# Altium project MainBoard.PrjPcb
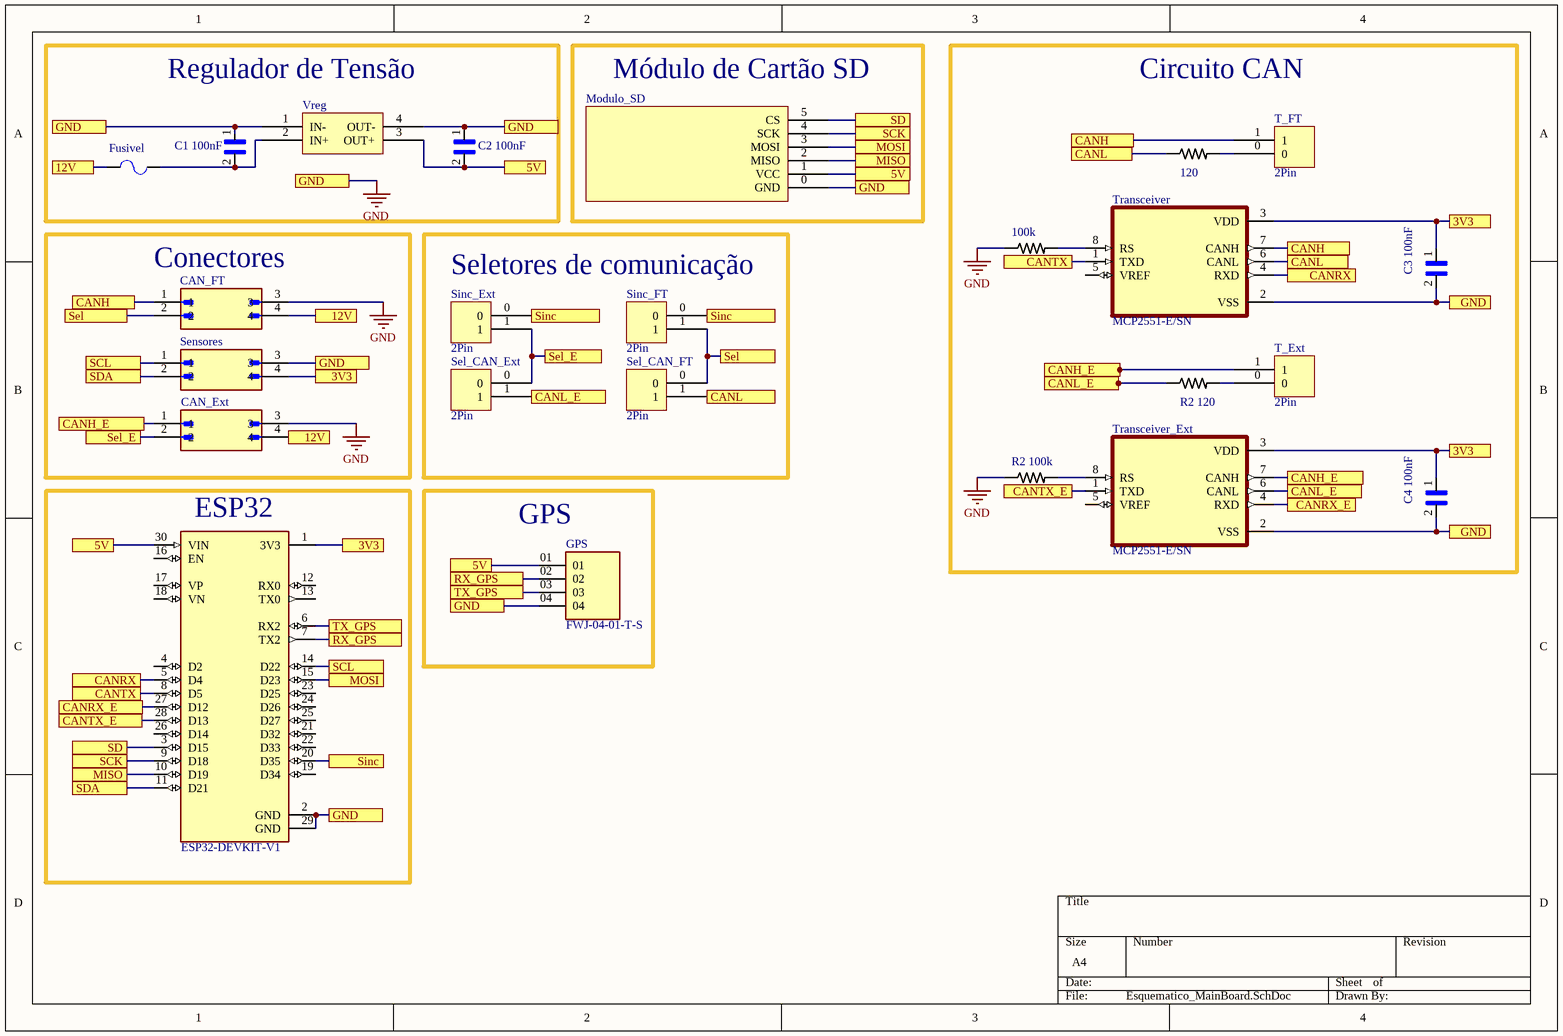
[diagram p0: Esquematico_MainBoard.SchDoc]
1 sheet, 24 parts. Net scope: flat (ports and power ports of the same name join across sheets).
Board file: PCB_MainBoard_Final.PcbDoc

## Sheet Esquematico_MainBoard.SchDoc
size A4; SheetNumber: 1; SheetTotal: 1

### Parts
100k  CRG1206F620K  [RESC3115X65N]  (value not drawn)
120  CRG1206F620K  [RESC3115X65N]  (value not drawn)
C1_100nF  C2012X5R1E225M085AC  [*CAPC2012X100N]  (value not drawn)
C2_100nF  C2012X5R1E225M085AC  [*CAPC2012X100N]  (value not drawn)
C3_100nF  C2012X5R1E225M085AC  [*CAPC2012X100N]  (value not drawn)
C4_100nF  C2012X5R1E225M085AC  [*CAPC2012X100N]  (value not drawn)
CAN_Ext  874270402  [MOLEX_874270402]  (value not drawn)
CAN_FT  874270402  [MOLEX_874270402]  (value not drawn)
Fusivel  F1206B3R00FWTR  [*FUSM3216X140N]  (value not drawn)
GPS  FWJ-04-01-T-S  [SAMTEC_FWJ-04-01-T-S]
Modulo_SD  Component_1  [MICROSD_MODULE]  (value not drawn)
R2_100k  CRG1206F620K  [RESC3115X65N]  (value not drawn)
R2_120  CRG1206F620K  [RESC3115X65N]  (value not drawn)
Sel_CAN_Ext  2Pin  [2Pin]
Sel_CAN_FT  2Pin  [2Pin]
Sensores  874270402  [MOLEX_874270402]  (value not drawn)
Sinc_Ext  2Pin  [2Pin]
Sinc_FT  2Pin  [2Pin]
T_Ext  2Pin  [2Pin]
T_FT  2Pin  [2Pin]
Transceiver  MCP2551-E/SN  [SOIC127P600X175-8N]
Transceiver_Ext  MCP2551-E/SN  [SOIC127P600X175-8N]
Vreg  Component_1  [PCBComponent_1]  (value not drawn)
  ESP32-DEVKIT-V1  [MODULE_ESP32_DEVKIT_V1]

### Blocks framed on the sheet
Regulador de Tensão: C1_100nF C2_100nF Fusivel Vreg
Módulo de Cartão SD: Modulo_SD
Circuito CAN: 100k 120 C3_100nF C4_100nF R2_100k R2_120 T_Ext T_FT Transceiver Transceiver_Ext
Conectores: CAN_Ext CAN_FT Sensores
Seletores de comunicação: Sel_CAN_Ext Sel_CAN_FT Sinc_Ext Sinc_FT
ESP32: 
GPS: GPS

### Ports
3V3, 5V, 12V, CANH, CANH_E, CANL, CANL_E, CANRX, CANRX_E, CANTX, CANTX_E, GND, MISO, MOSI, RX_GPS, SCK, SCL, SD, SDA, Sel, Sel_E, Sinc, TX_GPS

### Nets
GND: 100k.1 C1_100nF.1 C2_100nF.1 C3_100nF.2 C4_100nF.2 CAN_Ext.3 CAN_FT.3 GPS.04 Modulo_SD.0(GND) R2_100k.1 Sensores.3 Transceiver.2(VSS) Transceiver_Ext.2(VSS) Vreg.1(IN-) Vreg.4(OUT-) .2(GND) .29(GND) ; port GND
Net100k_2: 100k.2 Transceiver.8(RS)
Net120_1: 120.1 Sel_CAN_FT.1 Transceiver.6(CANL) ; port CANL
Net120_2: 120.2 T_FT.0
NetC1_100nF_2: C1_100nF.2 Fusivel.2 Vreg.2(IN+)
NetC2_100nF_2: C2_100nF.2 GPS.01 Modulo_SD.1(VCC) Vreg.3(OUT+) .30(VIN) ; port 5V
NetC3_100nF_1: C3_100nF.1 C4_100nF.1 Sensores.4 Transceiver.3(VDD) Transceiver_Ext.3(VDD) .1(3V3) ; port 3V3
NetCAN_Ext_1: CAN_Ext.1 T_Ext.1 Transceiver_Ext.7(CANH) ; port CANH_E
NetCAN_Ext_2: CAN_Ext.2 Sel_CAN_Ext.0 Sinc_Ext.1 ; port Sel_E
NetCAN_Ext_4: CAN_Ext.4 CAN_FT.4 Fusivel.1 ; port 12V
NetCAN_FT_1: CAN_FT.1 T_FT.1 Transceiver.7(CANH) ; port CANH
NetCAN_FT_2: CAN_FT.2 Sel_CAN_FT.0 Sinc_FT.1 ; port Sel
NetGPS_02: GPS.02 .7(TX2) ; port RX_GPS
NetGPS_03: GPS.03 .6(RX2) ; port TX_GPS
NetModulo_SD_2: Modulo_SD.2(MISO) .10(D19) ; port MISO
NetModulo_SD_3: Modulo_SD.3(MOSI) .15(D23) ; port MOSI
NetModulo_SD_4: Modulo_SD.4(SCK) .9(D18) ; port SCK
NetModulo_SD_5: Modulo_SD.5(CS) .3(D15) ; port SD
NetR2_100k_2: R2_100k.2 Transceiver_Ext.8(RS)
NetR2_120_1: R2_120.1 Sel_CAN_Ext.1 Transceiver_Ext.6(CANL) ; port CANL_E
NetR2_120_2: R2_120.2 T_Ext.0
NetSensores_1: Sensores.1 .14(D22) ; port SCL
NetSensores_2: Sensores.2 .11(D21) ; port SDA
NetSinc_Ext_0: Sinc_Ext.0 Sinc_FT.0 .20(D35) ; port Sinc
NetTransceiver_1: Transceiver.1(TXD) .8(D5) ; port CANTX
NetTransceiver_4: Transceiver.4(RXD) .5(D4) ; port CANRX
NetTransceiver_Ext_1: Transceiver_Ext.1(TXD) .28(D13) ; port CANTX_E
NetTransceiver_Ext_4: Transceiver_Ext.4(RXD) .27(D12) ; port CANRX_E

Not connected (* = marked no-connect by the designer): Transceiver 5(VREF); Transceiver_Ext 5(VREF);  4(D2) 12(RX0) 13(TX0) 16(EN) 17(VP) 18(VN) 19(D34) 21(D32) 22(D33) 23(D25) 24(D26) 25(D27) 26(D14)

### Library data of the parts
100k 120 R2_100k R2_120 = CRG1206F620K: Res Thick Film 1206 620K Ohm 1% 0.25W_1/4W_ Â±100ppm/C Pad SMD T/R; MF: TE Connectivity; Package: 1206 TE Connectivity; Price: 0.00 USD; MP: CRG1206F620K; Availability: Unavailable; SnapEDA_Link: https://www.snapeda.com/parts/CRG1206F620K/TE%20Connectivity%20/%20DEUTSCH/view-part/?ref=snap; Value: *
C1_100nF C2_100nF C3_100nF C4_100nF = C2012X5R1E225M085AC: Cap Ceramic 2.2uF 25V X5R 20% SMD 0805 85Â°C Punched Paper T/R; MF: TDK; Package: 0805 TDK; MP: C2012X5R1E225M085AC; Availability: Unavailable; Price: None; SnapEDA_Link: https://www.snapeda.com/parts/C2012X5R1E225M085AC/TDK/view-part/?ref=snap; Value: *
CAN_Ext CAN_FT Sensores = 874270402: Conn Wire to Board HDR 4 POS 4.2mm Solder RA Side Entry Thru-Hole Mini-Fit Jrâ„¢ Tray; MF: Molex; MP: 874270402; Package: None; SnapEDA_Link: https://www.snapeda.com/parts/874270402/Molex/view-part/?ref=snap; Check_prices: https://www.snapeda.com/parts/874270402/Molex/view-part/?ref=eda; Availability: In Stock; Value: *; Purchase-URL: https://pricing.snapeda.com/search/part/874270402/?ref=eda; Price: None
Fusivel = F1206B3R00FWTR: F1206B Series Fast Acting 63 V 3 A 1206 Surface Mount Thin-Film Fuse T&R; MF: AVX; SnapEDA_Link: https://www.snapeda.com/parts/F1206B3R00FWTR/AVX%20/%20Kyocera/view-part/?ref=snap; Package: 1206 AVX; MP: F1206B3R00FWTR; Availability: Unavailable; Price: None; Value: *
GPS = FWJ-04-01-T-S: Connector Header Through Hole 4 position 0.156 (3.96mm); MF: Samtec; Availability: Bad; Package: None; Check_prices: https://www.snapeda.com/parts/FWJ-04-01-T-S/Samtec/view-part/3573755/?ref=eda; Price: None; SnapEDA_Link: https://www.snapeda.com/parts/FWJ-04-01-T-S/Samtec/view-part/3573755/?ref=snap; MP: FWJ-04-01-T-S; Purchase-URL: https://pricing.snapeda.com/search/part/FWJ-04-01-T-S/?ref=eda; Value: *
Transceiver Transceiver_Ext = MCP2551-E/SN: 1/1 Transceiver Half CANbus 8-SOIC; MF: Microchip; Check_prices: https://www.snapeda.com/parts/MCP2551-E/SN/Microchip/view-part/?ref=eda; Value: *; Availability: In Stock; MP: MCP2551-E/SN; Price: None; Package: SOIC-8 Microchip; SnapEDA_Link: https://www.snapeda.com/parts/MCP2551-E/SN/Microchip/view-part/?ref=snap; Purchase-URL: https://pricing.snapeda.com/search/part/MCP2551-E/SN/?ref=eda
 = ESP32-DEVKIT-V1: Dual core, Wi-Fi: 2.4 GHz up to 150 Mbits/s,BLE (Bluetooth Low Energy) and legacy Bluetooth, 32 bits, Up to 240 MHz; MF: Do it